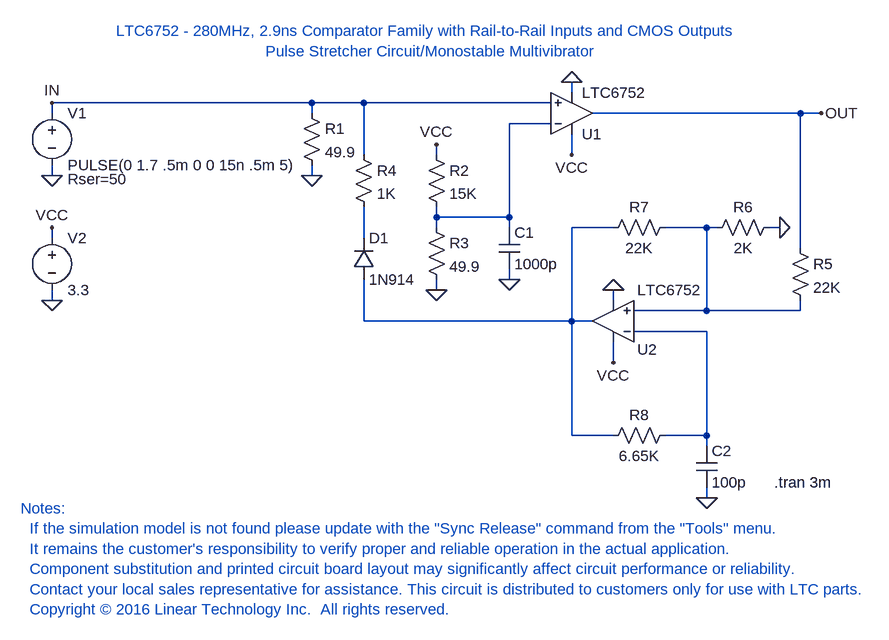
[diagram p0: schematic LTC6752_F12.asc]
LTC6752_F12.asc, the LTspice schematic file:
Version 4
SHEET 1 1956 1060
WIRE 592 -176 592 -192
WIRE 192 -160 -208 -160
WIRE 272 -160 192 -160
WIRE 560 -160 272 -160
WIRE -208 -144 -208 -160
WIRE 192 -144 192 -160
WIRE 944 -144 624 -144
WIRE 976 -144 944 -144
WIRE 560 -128 496 -128
WIRE 272 -80 272 -160
WIRE 384 -80 384 -96
WIRE 592 -80 592 -112
WIRE -208 -48 -208 -64
WIRE 192 -48 192 -64
WIRE 384 16 384 0
WIRE 496 16 496 -128
WIRE 496 16 384 16
WIRE 384 32 384 16
WIRE 496 32 496 16
WIRE 656 32 592 32
WIRE 800 32 736 32
WIRE 816 32 800 32
WIRE 912 32 896 32
WIRE -208 48 -208 32
WIRE 272 48 272 0
WIRE 944 64 944 -144
WIRE 496 112 496 96
WIRE 384 128 384 112
WIRE -208 144 -208 128
WIRE 656 144 656 128
WIRE 800 160 800 32
WIRE 800 160 688 160
WIRE 944 160 944 144
WIRE 944 160 800 160
WIRE 272 176 272 112
WIRE 592 176 592 32
WIRE 592 176 272 176
WIRE 624 176 592 176
WIRE 800 192 688 192
WIRE 656 240 656 208
WIRE 592 352 592 176
WIRE 656 352 592 352
WIRE 800 352 800 192
WIRE 800 352 736 352
WIRE 800 368 800 352
WIRE 800 448 800 432
FLAG -208 144 0
FLAG 592 -192 0
FLAG 976 -144 OUT
FLAG -208 -48 0
FLAG -208 32 VCC
FLAG 592 -80 VCC
FLAG 656 128 0
FLAG 656 240 VCC
FLAG 192 -48 0
FLAG 384 -96 VCC
FLAG 384 128 0
FLAG 496 112 0
FLAG 912 32 0
FLAG 800 448 0
FLAG -208 -160 IN
SYMBOL voltage -208 32 R0
WINDOW 123 24 138 Left 2
WINDOW 39 24 117 Left 2
SYMATTR InstName V2
SYMATTR Value 3.3
SYMBOL LTC6752 592 -80 M180
SYMATTR InstName U1
SYMBOL voltage -208 -160 R0
WINDOW 123 24 138 Left 2
WINDOW 39 24 117 Left 2
SYMATTR InstName V1
SYMATTR Value PULSE(0 1.7 .5m 0 0 15n .5m 5)
SYMATTR SpiceLine Rser=50
SYMBOL LTC6752 656 240 R180
WINDOW 0 -68 20 Left 2
WINDOW 3 -137 112 Left 2
SYMATTR InstName U2
SYMBOL res 176 -160 R0
SYMATTR InstName R1
SYMATTR Value 49.9
SYMBOL res 368 -96 R0
SYMATTR InstName R2
SYMATTR Value 15K
SYMBOL res 368 16 R0
SYMATTR InstName R3
SYMATTR Value 49.9
SYMBOL cap 480 32 R0
SYMATTR InstName C1
SYMATTR Value 1000p
SYMBOL res 256 -96 R0
SYMATTR InstName R4
SYMATTR Value 1K
SYMBOL diode 256 112 M180
WINDOW 0 24 64 Left 2
WINDOW 3 24 0 Left 2
SYMATTR InstName D1
SYMATTR Value 1N914
SYMBOL res 928 48 R0
SYMATTR InstName R5
SYMATTR Value 22K
SYMBOL res 912 16 R90
WINDOW 0 0 56 VBottom 2
WINDOW 3 32 56 VTop 2
SYMATTR InstName R6
SYMATTR Value 2K
SYMBOL res 752 16 R90
WINDOW 0 0 56 VBottom 2
WINDOW 3 32 56 VTop 2
SYMATTR InstName R7
SYMATTR Value 22K
SYMBOL res 752 336 R90
WINDOW 0 0 56 VBottom 2
WINDOW 3 32 56 VTop 2
SYMATTR InstName R8
SYMATTR Value 6.65K
SYMBOL cap 784 368 R0
SYMATTR InstName C2
SYMATTR Value 100p
TEXT 904 424 Left 2 !.tran 3m
TEXT 376 -224 Bottom 2 ;LTC6752 - 280MHz, 2.9ns Comparator Family with Rail-to-Rail Inputs and CMOS Outputs \nPulse Stretcher Circuit/Monostable Multivibrator
TEXT -256 464 Left 2 ;Notes:\n  If the simulation model is not found please update with the "Sync Release" command from the "Tools" menu.\n  It remains the customer's responsibility to verify proper and reliable operation in the actual application.\n  Component substitution and printed circuit board layout may significantly affect circuit performance or reliability.\n  Contact your local sales representative for assistance. This circuit is distributed to customers only for use with LTC parts.\n  Copyright © 2016 Linear Technology Inc.  All rights reserved.

The netlist it stands for:
* LTC6752_F12.asc
V2 VCC 0 3.3
XU1 IN N001 VCC 0 OUT LTC6752  ; pins In+ In- V+ V- OUT
V1 IN 0 PULSE(0 1.7 .5m 0 0 15n .5m 5) Rser=50
XU2 N003 N005 VCC 0 N002 LTC6752  ; pins In+ In- V+ V- OUT
R1 IN 0 49.9
R2 VCC N001 15K
R3 N001 0 49.9
C1 N001 0 1000p
R4 IN N004 1K
D1 N002 N004 1N914
R5 OUT N003 22K
R6 0 N003 2K
R7 N003 N002 22K
R8 N005 N002 6.65K
C2 N005 0 100p
.model D D
.lib standard.dio
.tran 3m
* LTC6752 - 280MHz, 2.9ns Comparator Family with Rail-to-Rail Inputs and CMOS Outputs
* Pulse Stretcher Circuit/Monostable Multivibrator
* Notes:
*   If the simulation model is not found please update with the "Sync Release" command from the "Tools" menu.
*   It remains the customer's responsibility to verify proper and reliable operation in the actual application.
*   Component substitution and printed circuit board layout may significantly affect circuit performance or reliability.
*   Contact your local sales representative for assistance. This circuit is distributed to customers only for use with LTC parts.
*   Copyright © 2016 Linear Technology Inc.  All rights reserved.
.lib LTC7.lib
.backanno
.end